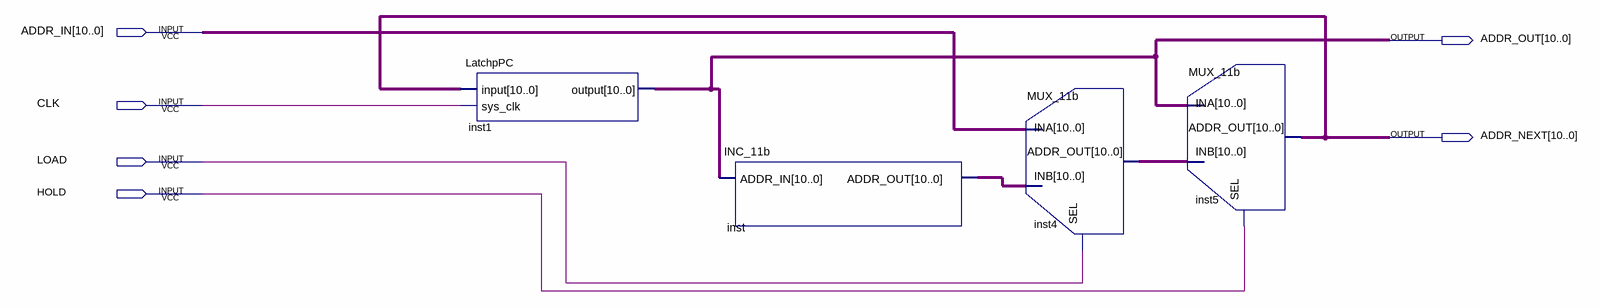
[diagram p0: schematic sheet]
// Quartus schematic PC.bdf as structural Verilog: 4 symbols, 6 pins
module PC (
  input  [10:0] ADDR_IN,
  input  CLK,
  input  LOAD,
  input  HOLD,
  output [10:0] ADDR_OUT,
  output [10:0] ADDR_NEXT
);

  wire [10:0] inst4_addr_out, inst_addr_out;

  LatchpPC inst1 (.\input (ADDR_NEXT), .sys_clk(CLK), .\output (ADDR_OUT));
  INC_11b inst (.ADDR_IN(ADDR_OUT), .ADDR_OUT(inst_addr_out));
  MUX_11b inst4 (.INA(ADDR_IN), .SEL(LOAD), .INB(inst_addr_out), .ADDR_OUT(inst4_addr_out));
  MUX_11b inst5 (.INA(ADDR_OUT), .SEL(HOLD), .INB(inst4_addr_out), .ADDR_OUT(ADDR_NEXT));
endmodule
